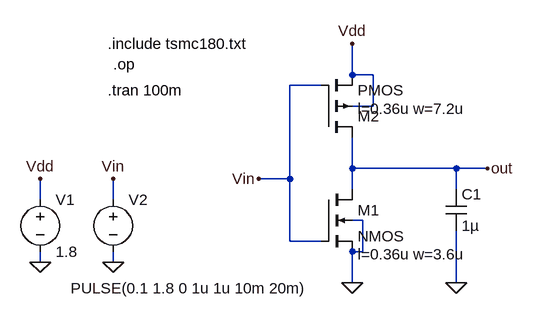
[diagram p0: schematic Delay Cell Active comp.asc]
Delay Cell Active comp.asc, the LTspice schematic file:
Version 4
SHEET 1 880 680
WIRE 224 32 224 -16
WIRE 256 32 224 32
WIRE 176 48 128 48
WIRE 256 80 256 32
WIRE 256 80 224 80
WIRE 224 176 224 128
WIRE 384 176 224 176
WIRE 432 176 384 176
WIRE 128 192 128 48
WIRE 128 192 80 192
WIRE 224 208 224 176
WIRE 384 208 384 176
WIRE -256 224 -256 192
WIRE -144 224 -144 192
WIRE 240 256 224 256
WIRE 128 288 128 192
WIRE 176 288 128 288
WIRE 240 304 240 256
WIRE 240 304 224 304
WIRE -256 320 -256 304
WIRE -144 320 -144 304
WIRE 224 352 224 304
WIRE 384 352 384 272
FLAG 224 -16 Vdd
FLAG 432 176 out
FLAG 224 352 0
FLAG -144 320 0
FLAG -256 320 0
FLAG -256 192 Vdd
FLAG -144 192 Vin
FLAG 80 192 Vin
FLAG 384 352 0
SYMBOL nmos4 176 208 R0
WINDOW 123 56 100 Left 2
SYMATTR Value2 l=0.36u w=3.6u
SYMATTR InstName M1
SYMBOL voltage -256 208 R0
WINDOW 123 0 0 Left 0
WINDOW 39 0 0 Left 0
SYMATTR InstName V1
SYMATTR Value 1.8
SYMBOL voltage -144 208 R0
WINDOW 3 -65 152 Left 2
WINDOW 123 0 0 Left 0
WINDOW 39 0 0 Left 0
SYMATTR InstName V2
SYMATTR Value PULSE(0.1 1.8 0 1u 1u 10m 20m)
SYMBOL pmos4 176 128 M180
WINDOW 123 56 44 Left 2
SYMATTR InstName M2
SYMATTR Value2 l=0.36u w=7.2u
SYMBOL cap 368 208 R0
SYMATTR InstName C1
SYMATTR Value 1µ
TEXT -152 -16 Left 2 !.include tsmc180.txt
TEXT -144 16 Left 2 !.op
TEXT -152 56 Left 2 !.tran 100m

The netlist it stands for:
* Delay Cell Active comp.asc
M1 out Vin 0 0 NMOS l=0.36u w=3.6u
V1 Vdd 0 1.8
V2 Vin 0 PULSE(0.1 1.8 0 1u 1u 10m 20m)
M2 out Vin Vdd Vdd PMOS l=0.36u w=7.2u
C1 out 0 1µ
.model NMOS NMOS
.model PMOS PMOS
.lib standard.mos
.include tsmc180.txt
.op
.tran 100m
.backanno
.end